# Altium schematic sheet 模拟量输入输出电路.SchDoc
size A4; SheetNumber: 5; SheetTotal: 7
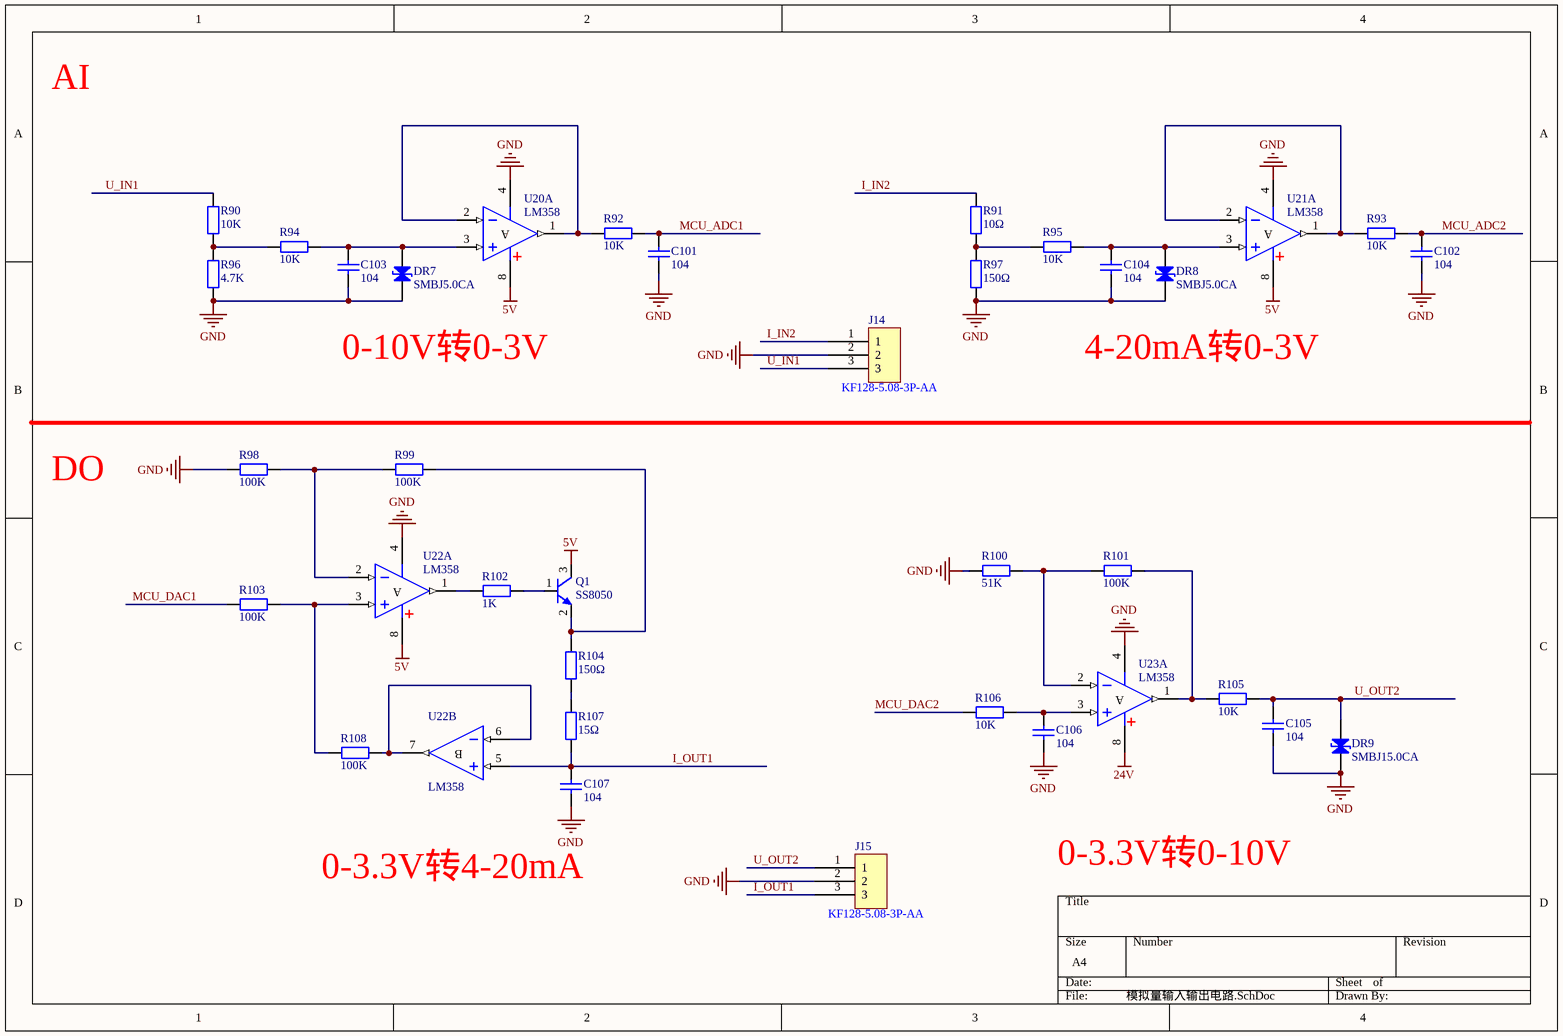
[diagram p0: 模拟量输入输出电路.SchDoc]

## Parts
C101  104  [C 0603_L]
C102  104  [C 0603_L]
C103  104  [C 0603_L]
C104  104  [C 0603_L]
C105  104  [C 0603_L]
C106  104  [C 0603_L]
C107  104  [C 0603_L]
DR7  SMBJ5.0CA  [SMB]
DR8  SMBJ5.0CA  [SMB]
DR9  SMBJ15.0CA  [SMB]
J14  KF128-5.08-3P-AA  [KF128-5.08-3P]
J15  KF128-5.08-3P-AA  [KF128-5.08-3P]
Q1  SS8050  [SOT-23_S8050]
R90  10K  [R 0603_L]
R91  10Ω  [R 0603_L]
R92  10K  [R 0603_L]
R93  10K  [R 0603_L]
R94  10K  [R 0603_L]
R95  10K  [R 0603_L]
R96  4.7K  [R 0603_L]
R97  150Ω  [R 0603_L]
R98  100K  [R 0603_L]
R99  100K  [R 0603_L]
R100  51K  [R 0603_L]
R101  100K  [R 0603_L]
R102  1K  [R 0603_L]
R103  100K  [R 0603_L]
R104  150Ω  [R 0603_L]
R105  10K  [R 0603_L]
R106  10K  [R 0603_L]
R107  15Ω  [R 0603_L]
R108  100K  [R 0603_L]
U20  LM358  [SOP8]  (part A of 2)
U21  LM358  [SOP8]  (part A of 2)
U22  LM358  [SOP8]  (parts A,B of 2)
U23  LM358  [SOP8]  (part A of 2)

## Nets
5V: Q1.3(C) U20.8(V+) U21.8(V+) U22.8(V+)
24V: U23.8(V+)
GND: C101.1 C102.1 C103.1 C104.1 C105.1 C106.1 C107.1 DR7.2(K) DR8.2(K) DR9.2(K) J14.2 J15.2 R96.1 R97.1 R98.2 R100.2 U20.4(V-) U21.4(V-) U22.4(V-) U23.4(V-)
I_IN2: J14.1 R91.2
I_OUT1: C107.2 J15.3 R107.2 U22.5(IN+)
MCU_ADC1: C101.2 R92.1
MCU_ADC2: C102.2 R93.1
MCU_DAC1: R103.2
MCU_DAC2: R106.2
U_IN1: J14.3 R90.2
U_OUT2: C105.2 DR9.1(A) J15.1 R105.1
NetC103_2: C103.2 DR7.1(A) R94.1 U20.3(IN+)
NetC104_2: C104.2 DR8.1(A) R95.1 U21.3(IN+)
NetC106_2: C106.2 R106.1 U23.3(IN+)
NetQ1_1: Q1.1(B) R102.1
NetQ1_2: Q1.2(E) R99.1 R104.1
NetR90_1: R90.1 R94.2 R96.2
NetR91_1: R91.1 R95.2 R97.2
NetR92_2: R92.2 U20.1(OUT) U20.2(IN-)
NetR93_2: R93.2 U21.1(OUT) U21.2(IN-)
NetR98_1: R98.1 R99.2 U22.2(IN-)
NetR100_1: R100.1 R101.2 U23.2(IN-)
NetR101_1: R101.1 R105.2 U23.1(OUT)
NetR102_2: R102.2 U22.1(OUT)
NetR103_1: R103.1 R108.2 U22.3(IN+)
NetR104_2: R104.2 R107.1
NetR108_1: R108.1 U22.6(IN-) U22.7(OUT)

## Notes on the sheet
- AI
- 0-10V转0-3V
- 4-20mA转0-3V
- DO
- 0-3.3V转4-20mA
- 0-3.3V转0-10V
- (in symbol LM358, part A) A
- (in symbol LM358, part B) B

## Library data of the parts
C101-C107 = Cap: 0603贴片电容; Published: 8-Jun-2000; LatestRevisionDate: 17-Jul-2002; LatestRevisionNote: Re-released for DXP Platform.; PackageReference: RAD-0.3; Publisher: Altium Limited; PackageDescription: Radial Cap, Thru-Hole; 2 Leads; 0.3 in Pin Spacing
DR7-DR9 = TVS: SMA，瞬态电压抑制二极管; 版权归属: 源创客; BOM名称: 瞬态电压抑制二极管; 学习资源: www.ooocke.com
J14 J15 = KF128-5.08-3P-AA: KF128-5.08-3P-AA端座; Manufacturer: KEFA(科发); Add into BOM: yes; Structure: 1x3P; Pitch: 5.08mm; Current Rating (Max): 24A; Voltage Rating (Max): 250V; Wire Gauge - AWG: 12~22; Wire Gauge - mm2: 2.5; Number of PINs Per Row: 3; Symbol: KF128-5.08-3P; Device: KF128-5.08-3P-AA; LCSC Part Name: 5.08mm 1x3P 排数:1 每排P数:3 直插; Supplier Part: C474953; Manufacturer Part: KF128-5.08-3P-AA; Supplier Footprint: 插件,P=5.08mm; JLCPCB Part Class: 扩展库; Datasheet: https://atta.szlcsc.com/upload/public/pdf/source/20230317/DADFED05827EAD48C1D5B8C3D4CF88F4.pdf; Supplier: LCSC; Convert to PCB: yes; Color: 绿色; Mounting Style: 直插; Number of Pins: 3P; Number of Rows: 1; Operating Temperature Range: -40℃~+105℃
Q1 = S8050: NPN三极管; BOM名称: 高频放大-NPN型; 版权归属: 源创客; 属性: 40V 1.5A 1W 100MHZ; 学习资源: www.ooocke.com
R90-R103 R105 R106 R108 = Res: C0603贴片电阻; BOM名称: 贴片电阻; 版权归属: 源创客; 学习资源: www.ooocke.com
R104 R107 = Res: 0603贴片电阻; BOM名称: 贴片电阻; 版权归属: 源创客; 学习资源: www.ooocke.com
U20-U23 = LM358: 双路运放; 版权归属: 源创客; BOM名称: 双路运放; 学习资源: www.ooocke.com